# Altium schematic sheet FPGA_SPI_interface.SchDoc: foxBMS BMS-Extension
size A3; DocumentNumber: 14; SheetNumber: 14; SheetTotal: 14; Author: Fraunhofer IISB foxBMS Team; REL-DATE: 2017-05-16; VERSION: 1.0.2; GateName_1: G$1; SymbolName_1: FRAME_B_L; LibraryName: foxBMS_BMS-Master_V1.00_A; DeviceSetName: FRAME_B_L; GateName_2: G$2; SymbolName_2: DOCFIELD; SheetDescription: FPGA SPI Interface up to 45MHz
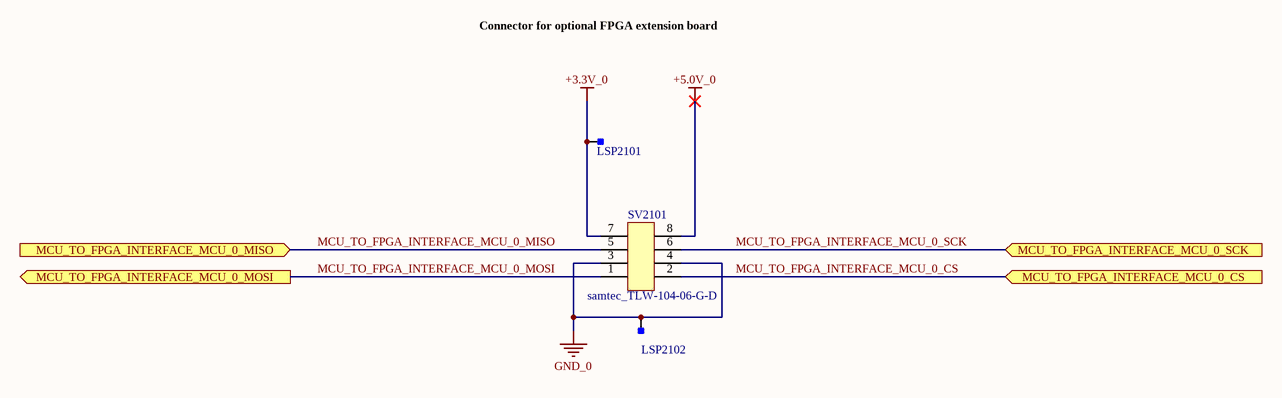
[diagram p0: FPGA_SPI_interface.SchDoc]

## Parts
LSP2101  Testpoint_Square  [Testpoint_S1]  (value not drawn)  (no BOM)
LSP2102  Testpoint_Square  [Testpoint_S1]  (value not drawn)  (no BOM)
SV2101  samtec_TLW-104-06-G-D  [Pinheader_2.54_2x4]

## Ports
MCU_TO_FPGA_INTERFACE_MCU_0_CS (in), MCU_TO_FPGA_INTERFACE_MCU_0_MISO (in), MCU_TO_FPGA_INTERFACE_MCU_0_MOSI (out), MCU_TO_FPGA_INTERFACE_MCU_0_SCK (in)

## Nets
+3.3V_0: LSP2101.1 SV2101.7
+5.0V_0: SV2101.8
GND_0: LSP2102.1 SV2101.3 SV2101.4
MCU_TO_FPGA_INTERFACE_MCU_0_CS: SV2101.2 ; port MCU_TO_FPGA_INTERFACE_MCU_0_CS
MCU_TO_FPGA_INTERFACE_MCU_0_MISO: SV2101.5 ; port MCU_TO_FPGA_INTERFACE_MCU_0_MISO
MCU_TO_FPGA_INTERFACE_MCU_0_MOSI: SV2101.1 ; port MCU_TO_FPGA_INTERFACE_MCU_0_MOSI
MCU_TO_FPGA_INTERFACE_MCU_0_SCK: SV2101.6 ; port MCU_TO_FPGA_INTERFACE_MCU_0_SCK

## Notes on the sheet
- Connector for optional FPGA extension board
- Fraunhofer IISB
- Schottkystr. 10
- developed by:
- 91058 Erlangen
- Germany
- Author
- Project
- License
- Description
- File
- Version
- Release Date
- Sheet
- www.foxbms.org
- www.iisb.fraunhofer.de
- foxBMS Team
- /

## Library data of the parts
LSP2101 LSP2102 = Testpoint_Square: Testpoint, square; Part Number: Testpoint_Square
SV2101 = samtec_TLW-104-06-G-D: Board-To-Board Connector, Vertical, Low Profile, 2.54 mm, 8 Contacts, Header, TLW Series, Through Hole, 2 Rows; Manufacturer: Samtec; Circuits: 8; Part Number: samtec_TLW-104-06-G-D; Part Name: TLW-104-06-G-D; Operating Temperature: -55°C - +125°C; ComponentLink1Description: Datasheet; ComponentLink1URL: http://suddendocs.samtec.com/catalog_english/tlw_th.pdf; Supplier 1: Digikey; Supplier Part Number 1: SAM1096-04-ND